# EAGLE design 522_jetson_xavier (EAGLE 9.6.2)
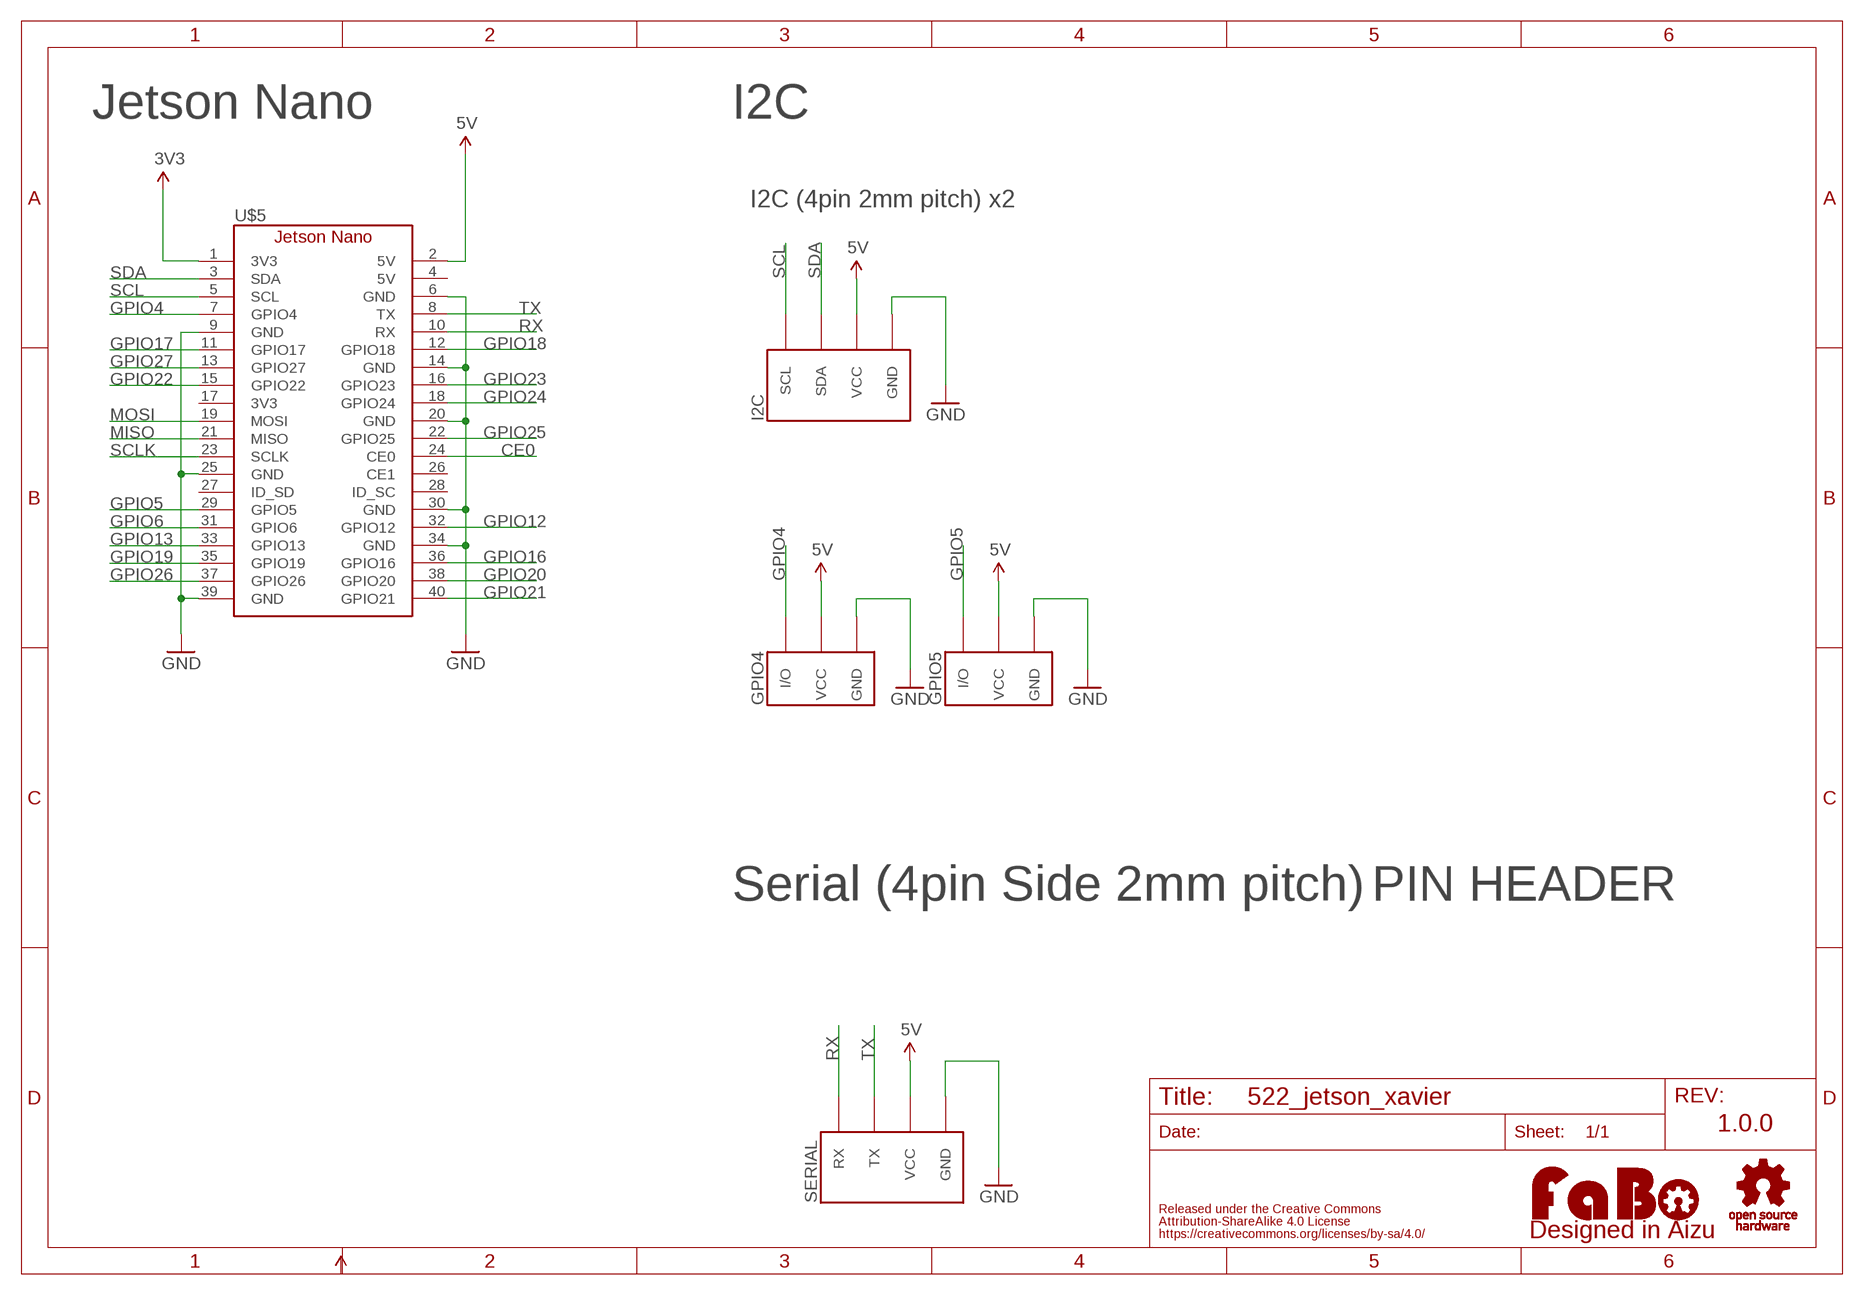
[diagram p0: schematic, sheet 1]

## Parts
GPIO4  FABO_BRICK_3PIN-B03B-PASK-1_SILK  [FABO_BRICK_3PIN_B03B-PASK-1_SILK]
GPIO5  FABO_BRICK_3PIN-B03B-PASK-1_SILK  [FABO_BRICK_3PIN_B03B-PASK-1_SILK]
I2C  FABO_BRICK_I2C-B04B-PASK-1_SILK  [FABO_BRICK_I2C_B04B-PASK-1_SILK]
LOGO1  LOGO_FABO-M  [LOGO_FABO_M]
SERIAL  FABO_BRICK_SERIAL-B04B-PASK-1_SILK  [FABO_BRICK_SERIAL_B04B-PASK-1_SILK]
U$2  LOGO_OSHW-M_BOTTOM  [LOGO_OSHW_M_BOTTOM]
U$5  JETSON_NANO_NOBORDER  [JETSON_NANO_NOBOARDER]

## Nets
3V3: U$5.1(3V3)
5V: GPIO4.VCC GPIO5.VCC I2C.VCC SERIAL.VCC U$5.2(5V)
CE0: U$5.24(CE0)
GND: GPIO4.GND GPIO5.GND I2C.GND SERIAL.GND U$5.6(GND) U$5.9(GND) U$5.14(GND) U$5.20(GND) U$5.25(GND) U$5.30(GND) U$5.34(GND) U$5.39(GND)
GPIO4: GPIO4.I/O U$5.7(GPIO4)
GPIO5: GPIO5.I/O U$5.29(GPIO5)
GPIO6: U$5.31(GPIO6)
GPIO12: U$5.32(GPIO12)
GPIO13: U$5.33(GPIO13)
GPIO16: U$5.36(GPIO16)
GPIO17: U$5.11(GPIO17)
GPIO18: U$5.12(GPIO18)
GPIO19: U$5.35(GPIO19)
GPIO20: U$5.38(GPIO20)
GPIO21: U$5.40(GPIO21)
GPIO22: U$5.15(GPIO22)
GPIO23: U$5.16(GPIO23)
GPIO24: U$5.18(GPIO24)
GPIO25: U$5.22(GPIO25)
GPIO26: U$5.37(GPIO26)
GPIO27: U$5.13(GPIO27)
MISO: U$5.21(MISO)
MOSI: U$5.19(MOSI)
RX: SERIAL.RX U$5.10(RX)
SCL: I2C.SCL U$5.5(SCL)
SCLK: U$5.23(SCLK)
SDA: I2C.SDA U$5.3(SDA)
TX: SERIAL.TX U$5.8(TX)
Unconnected: U$5.4(5V) U$5.17(3V3) U$5.26(CE1) U$5.27(ID_SD) U$5.28(ID_SC)

## Notes on the sheet
- Jetson Nano | I2C
- I2C (4pin 2mm pitch) x2
- Serial (4pin Side 2mm pitch) | PIN HEADER
- 1.0.0

## Library data of the parts
GPIO4 GPIO5 = FaBo-Template:FABO_BRICK_3PIN: FaBo Brick 3pin
I2C = FaBo-Template:FABO_BRICK_I2C: FaBo Brick I2C
LOGO1 = component:LOGO_FABO
SERIAL = FaBo-Template:FABO_BRICK_SERIAL: FaBo Brick Serial
U$2 = component:LOGO_OSHW
U$5 = FaBo-Boards:JETSON_NANO

## Board
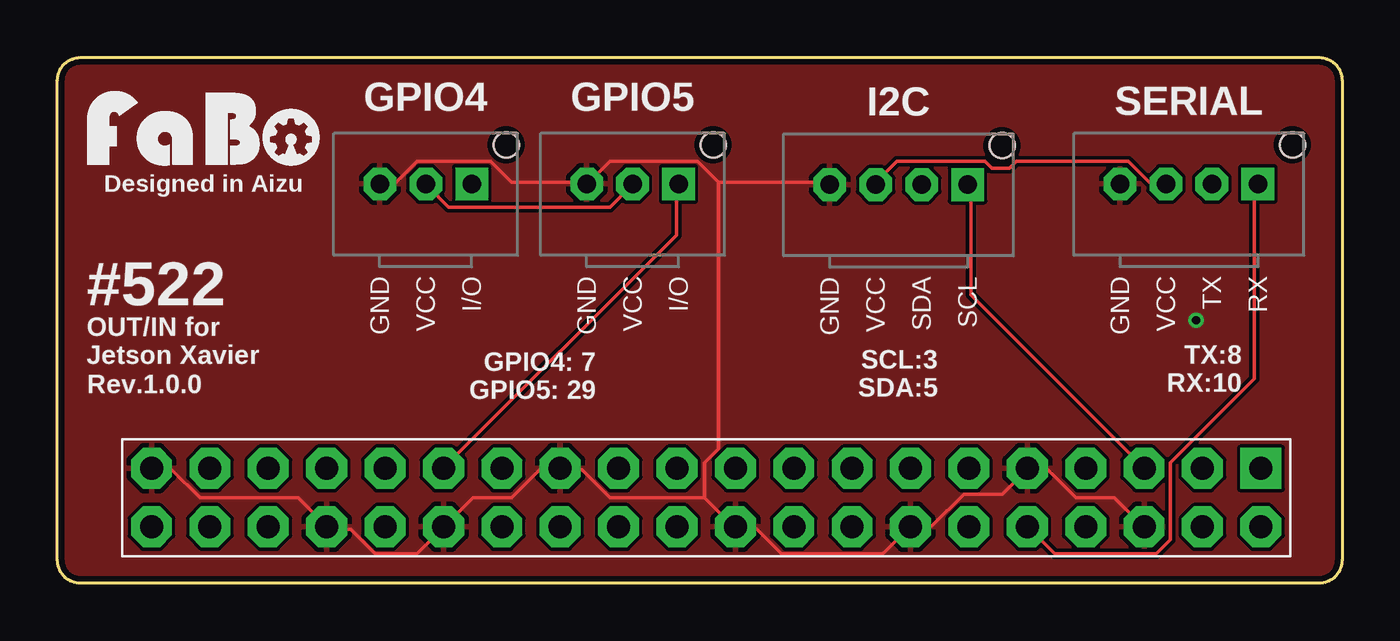
[diagram p1: board, top side]
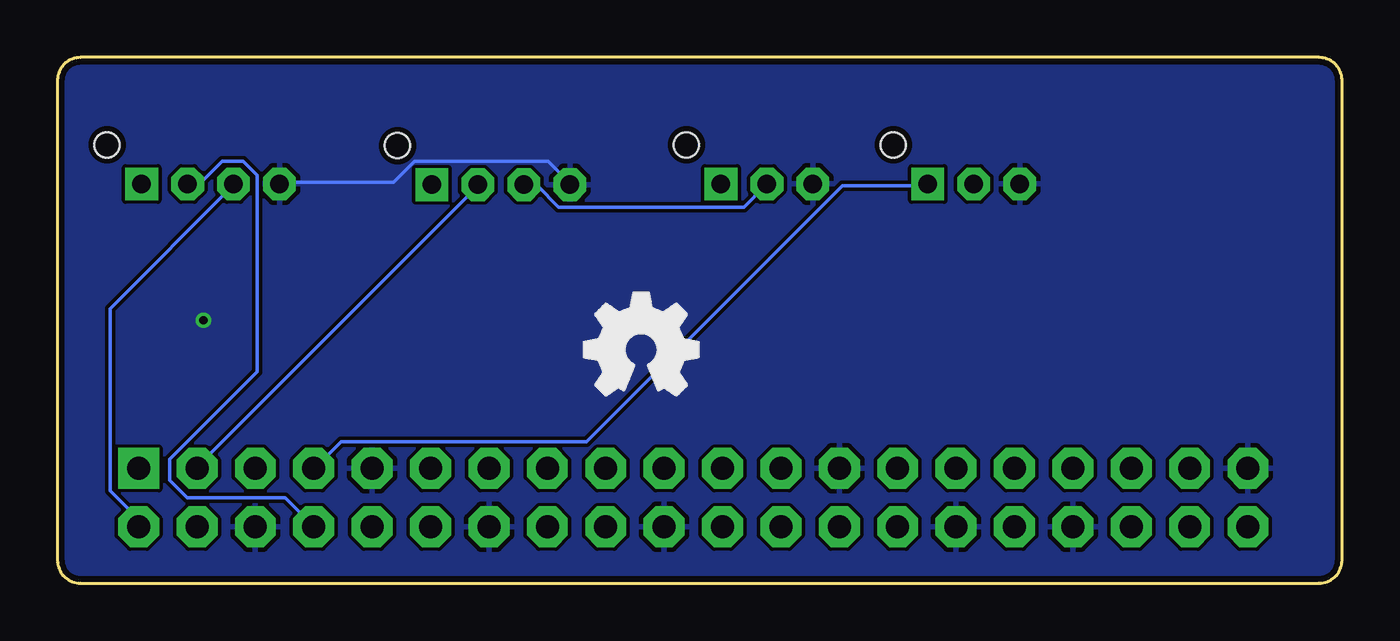
[diagram p2: board, bottom side, seen from below]

Size 55.88 x 22.86 mm. Coordinates in mm from the lower left corner, seen from the top.
Outline: 1,22.86 54.88,22.86 arc-90 55.88,21.86 55.88,1 arc-90 54.88,0 1,0 arc-90 0,1 0,21.86 arc-90 1,22.86
Copper layers (1*16): Top 0.035mm / dielectric 1.6mm / Bottom 0.035mm
Design rules "PCBway": minimum track width 6mil, minimum drill 12mil, track to track 6mil, track to pad 6mil, pad to pad 6mil, via to via 6mil, smd to smd 6mil, copper to edge 10mil, drill to drill 10mil, minimum pad ring 10mil, minimum via ring 6mil, stop-mask expansion 2mil, vias tented up to drill 100mil, thermal gap 8mil

### Footprints (pad centres in the part's own frame; a part is rotated, then mirrored left to right if it is on the bottom)
FABO_BRICK_3PIN_B03B-PASK-1_SILK = drill 0.8 pad 1.422 octagon: GND -2,0; VCC 0,0 | drill 0.8 pad 1.422 square: I/O 2,0 | hole 1.1: 3.5,1.7
FABO_BRICK_I2C_B04B-PASK-1_SILK = drill 0.8 pad 1.422 octagon: GND -3,0; SDA 1,0; VCC -1,0 | drill 0.8 pad 1.422 square: SCL 3,0 | hole 1.1: 4.5,1.7
FABO_BRICK_SERIAL_B04B-PASK-1_SILK = drill 0.8 pad 1.422 octagon: GND -3,0; TX 1,0; VCC -1,0 | drill 0.8 pad 1.422 square: RX 3,0 | hole 1.1: 4.5,1.7
JETSON_NANO_NOBOARDER = drill 1 pad 1.778 square: 1 1.27,1.27 | drill 1 pad 1.778 octagon: 2 1.27,3.81; 3 3.81,1.27; 4 3.81,3.81; 5 6.35,1.27; 6 6.35,3.81; 7 8.89,1.27; 8 8.89,3.81; 9 11.43,1.27; 10 11.43,3.81; 11 13.97,1.27; 12 13.97,3.81; 13 16.51,1.27; 14 16.51,3.81; 15 19.05,1.27; 16 19.05,3.81; 17 21.59,1.27; 18 21.59,3.81; 19 24.13,1.27; 20 24.13,3.81; 21 26.67,1.27; 22 26.67,3.81; 23 29.21,1.27; 24 29.21,3.81; 25 31.75,1.27; 26 31.75,3.81; 27 34.29,1.27; 28 34.29,3.81; 29 36.83,1.27; 30 36.83,3.81; 31 39.37,1.27; 32 39.37,3.81; 33 41.91,1.27; 34 41.91,3.81; 35 44.45,1.27; 36 44.45,3.81; 37 46.99,1.27; 38 46.99,3.81; 39 49.53,1.27; 40 49.53,3.81

### Placement (x,y rotation side)
GPIO4  16.02,17.36 0 top
GPIO5  25.02,17.36 0 top
I2C  36.59,17.33 0 top
LOGO1  6.35,17.78 0 top
SERIAL  49.22,17.36 0 top
U$2  30.48,10.16 0 top
U$4  [MARK_POINT_3MM]  70.52,33.96 0 top  (outside the outline)
U$5  53.62,6.26 180 top

### Tracks (layer width: path | path; a pad name or v marks a point on that pad's centre or on a via)
5V
  Top 0.152: GPIO4.VCC 16.1,17.27 17.02,16.36 24.03,16.36 24.94,17.27 GPIO5.VCC | SERIAL.VCC 48.11,17.42 47.5,17.42 46.58,18.34 41.71,18.34 41.4,18.03 40.64,18.03 40.34,18.34 36.52,18.34 35.61,17.42 I2C.VCC
  Bottom 0.152: I2C.VCC 35.46,17.27 35,17.27 34.09,16.36 26.01,16.36 25.09,17.27 GPIO5.VCC | U$5.2 52.38,2.49 52.38,2.79 53.59,4.01 53.59,11.94 48.26,17.27 SERIAL.VCC
GND  (via drill 0.35)
  Top 0.152: GPIO4.GND 14.12,17.42 14.73,17.42 15.65,18.34 18.85,18.34 19.76,17.42 22.96,17.42 GPIO5.GND 23.11,17.42 24.03,18.34 27.84,18.34 28.75,17.42 | 28.75,17.42 33.48,17.42 I2C.GND | U$5.39 4.22,4.93 4.98,4.93 6.2,3.71 10.46,3.71 11.68,2.49 U$5.34 11.84,2.34 12.75,2.34 13.82,1.27 15.65,1.27 16.71,2.34 U$5.30 16.87,2.49 18.09,3.71 19.76,3.71 20.98,4.93 21.74,4.93 U$5.25 21.9,4.93 22.81,4.93 24.03,3.71 28.14,3.71 | U$5.6 47.19,2.49 45.97,3.71 44.3,3.71 43.08,4.93 42.32,4.93 U$5.9 42.16,4.93 41.1,3.86 39.42,3.86 38.05,2.49 37.14,2.49 U$5.14 36.98,2.34 35.92,1.27 31.5,1.27 30.43,2.34 29.52,2.34 U$5.20 29.36,2.49 28.14,3.71 | 28.75,17.42 28.75,5.84 28.14,5.23 28.14,3.71
  Bottom 0.152: SERIAL.GND 46.13,17.42 41.25,17.42 40.34,18.34 34.54,18.34 33.63,17.42 I2C.GND
  other vias: 49.53,11.43
  pour Top: 0,-1.27 0,24.13 55.88,24.13 55.88,-1.27
  pour Bottom: 0,-1.27 0,24.13 55.88,24.13 55.88,-1.27
GPIO4
  Bottom 0.152: GPIO4.I/O 18.09,17.27 21.74,17.27 32.87,6.15 43.54,6.15 44.6,5.08 U$5.7
GPIO5
  Top 0.152: GPIO5.I/O 26.92,17.27 26.92,15.14 16.87,5.08 U$5.29
RX
  Top 0.152: SERIAL.RX 52.07,17.27 52.07,8.89 48.41,5.23 48.41,1.88 47.8,1.27 43.38,1.27 42.32,2.34 U$5.10
SCL
  Top 0.152: I2C.SCL 39.73,17.27 39.73,12.55 47.19,5.08 U$5.5
SDA
  Bottom 0.152: I2C.SDA 37.59,17.27 49.78,5.08 U$5.3
TX
  Bottom 0.152: SERIAL.TX 50.09,17.42 49.63,17.42 48.72,18.34 47.8,18.34 47.19,17.73 47.19,9.2 51,5.38 51,4.47 50.24,3.71 45.97,3.71 44.76,2.49 U$5.8

### Text on the board
tPlace: Designed in Aizu | #522 | GPIO4: 7 / GPIO5: 29 | SCL:3 / SDA:5 | TX:8 / RX:10 | OUT/IN for / Jetson Xavier | Rev.1.0.0